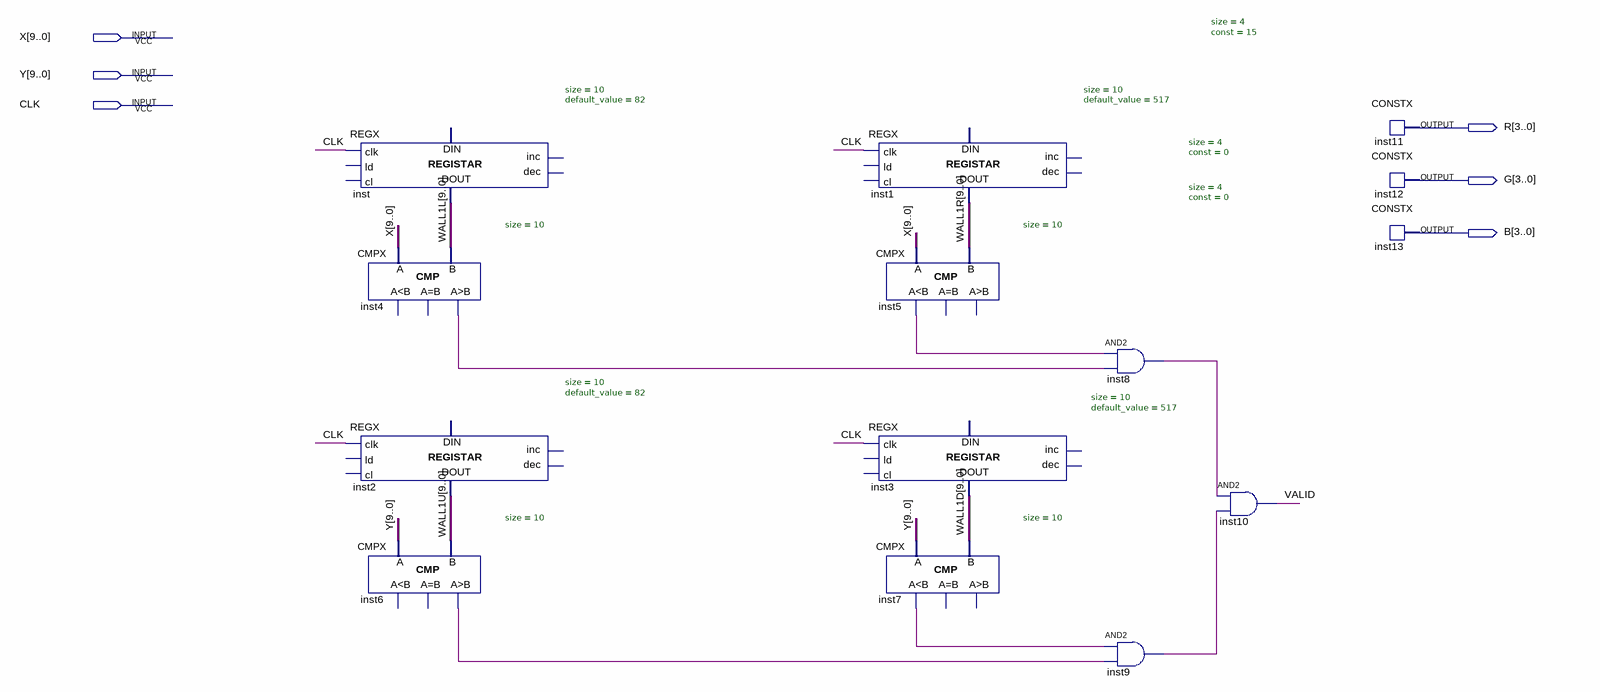
[diagram p0: schematic sheet]
// Quartus schematic Wall.bdf as structural Verilog: 14 symbols, 6 pins
module Wall (
  input  [9:0] X,
  input  [9:0] Y,
  input  CLK,
  output [3:0] R,
  output [3:0] G,
  output [3:0] B
);

  wire inst4_gr, inst5_ls, inst6_gr, inst7_ls, inst8_out, inst9_out, VALID;
  wire [9:0] WALL1D, WALL1L, WALL1R, WALL1U;

  REGX #(.size(10), .default_value(82)) inst (.clk(CLK), .data_out(WALL1L));  // open: ld, cl, inc, dec, data_in
  CMPX #(.size(10)) inst4 (.A(X), .B(WALL1L), .gr(inst4_gr));  // open: ls, eq
  REGX #(.size(10), .default_value(82)) inst2 (.clk(CLK), .data_out(WALL1U));  // open: ld, cl, inc, dec, data_in
  CMPX #(.size(10)) inst6 (.A(Y), .B(WALL1U), .gr(inst6_gr));  // open: ls, eq
  REGX #(.size(10), .default_value(517)) inst1 (.clk(CLK), .data_out(WALL1R));  // open: ld, cl, inc, dec, data_in
  CMPX #(.size(10)) inst5 (.A(X), .B(WALL1R), .ls(inst5_ls));  // open: eq, gr
  REGX #(.size(10), .default_value(517)) inst3 (.clk(CLK), .data_out(WALL1D));  // open: ld, cl, inc, dec, data_in
  CMPX #(.size(10)) inst7 (.A(Y), .B(WALL1D), .ls(inst7_ls));  // open: eq, gr
  and inst8 (inst8_out, inst5_ls, inst4_gr);
  and inst9 (inst9_out, inst7_ls, inst6_gr);
  and inst10 (VALID, inst8_out, inst9_out);
  CONSTX #(.size(4), .\const (15)) inst11 (.data(R));
  CONSTX #(.size(4), .\const (0)) inst12 (.data(G));
  CONSTX #(.size(4), .\const (0)) inst13 (.data(B));
endmodule
